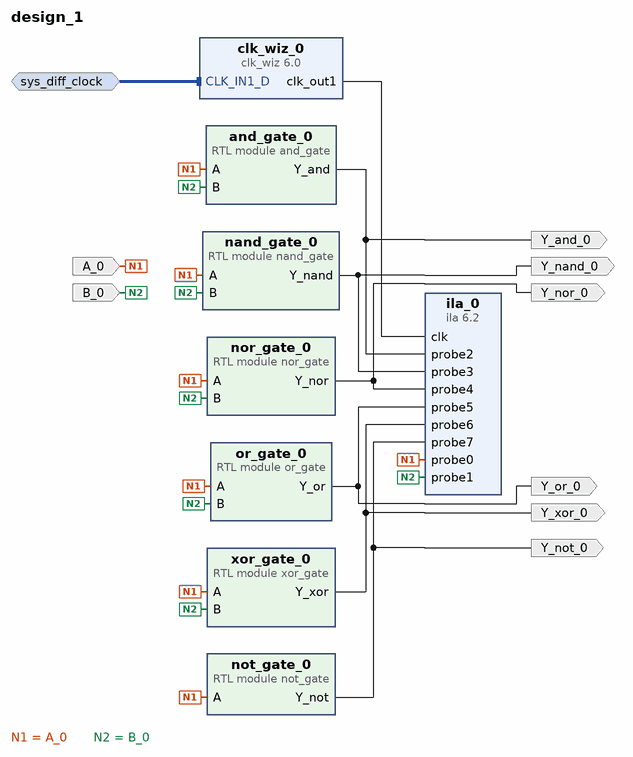
[diagram p0: block diagram of the top level]
# Vivado block design design_1, xc7z045ffg900-2, Vivado 2018.1
create_bd_design design_1

create_bd_intf_port -mode Slave -vlnv xilinx.com:interface:diff_clock_rtl:1.0 sys_diff_clock
set_property -dict {CONFIG.FREQ_HZ 200000000} [get_bd_intf_ports sys_diff_clock]
create_bd_port -dir I A_0
create_bd_port -dir I B_0
create_bd_port -dir O Y_and_0
create_bd_port -dir O Y_nand_0
create_bd_port -dir O Y_nor_0
create_bd_port -dir O Y_or_0
create_bd_port -dir O Y_xor_0
create_bd_port -dir O Y_not_0

create_bd_cell -type module -reference and_gate and_gate_0
create_bd_cell -type module -reference nand_gate nand_gate_0
create_bd_cell -type module -reference nor_gate nor_gate_0
create_bd_cell -type module -reference or_gate or_gate_0
create_bd_cell -type module -reference xor_gate xor_gate_0
create_bd_cell -type module -reference not_gate not_gate_0
create_bd_cell -type ip -vlnv xilinx.com:ip:ila:6.2 ila_0
set_property -dict [list \
  CONFIG.C_DATA_DEPTH 2048 \
  CONFIG.C_NUM_OF_PROBES 8 \
  CONFIG.C_ENABLE_ILA_AXI_MON false \
  CONFIG.C_MONITOR_TYPE Native \
] [get_bd_cells ila_0]
create_bd_cell -type ip -vlnv xilinx.com:ip:clk_wiz:6.0 clk_wiz_0
set_property -dict [list \
  CONFIG.CLKIN1_JITTER_PS 50.0 \
  CONFIG.PRIM_SOURCE Differential_clock_capable_pin \
  CONFIG.USE_LOCKED false \
  CONFIG.USE_RESET false \
  CONFIG.MMCM_DIVCLK_DIVIDE 1 \
  CONFIG.MMCM_CLKFBOUT_MULT_F 5.000 \
  CONFIG.MMCM_CLKIN1_PERIOD 5.000 \
  CONFIG.MMCM_CLKIN2_PERIOD 10.0 \
  CONFIG.USE_BOARD_FLOW true \
  CONFIG.CLK_IN1_BOARD_INTERFACE sys_diff_clock \
  CONFIG.CLKOUT1_JITTER 112.316 \
  CONFIG.CLKOUT1_PHASE_ERROR 89.971 \
] [get_bd_cells clk_wiz_0]

# ---- connections ----

connect_bd_intf_net [get_bd_intf_ports sys_diff_clock] [get_bd_intf_pins clk_wiz_0/CLK_IN1_D]
connect_bd_net -net A_0_1 [get_bd_ports A_0] \
  [get_bd_pins and_gate_0/A] [get_bd_pins nand_gate_0/A] [get_bd_pins nor_gate_0/A] [get_bd_pins or_gate_0/A] \
  [get_bd_pins xor_gate_0/A] [get_bd_pins not_gate_0/A] [get_bd_pins ila_0/probe0]
connect_bd_net -net B_0_1 [get_bd_ports B_0] \
  [get_bd_pins and_gate_0/B] [get_bd_pins nand_gate_0/B] [get_bd_pins nor_gate_0/B] [get_bd_pins or_gate_0/B] \
  [get_bd_pins xor_gate_0/B] [get_bd_pins ila_0/probe1]
connect_bd_net [get_bd_pins and_gate_0/Y_and] [get_bd_ports Y_and_0] [get_bd_pins ila_0/probe2]
connect_bd_net [get_bd_pins nand_gate_0/Y_nand] [get_bd_ports Y_nand_0] [get_bd_pins ila_0/probe3]
connect_bd_net [get_bd_pins nor_gate_0/Y_nor] [get_bd_ports Y_nor_0] [get_bd_pins ila_0/probe4]
connect_bd_net [get_bd_pins or_gate_0/Y_or] [get_bd_ports Y_or_0] [get_bd_pins ila_0/probe5]
connect_bd_net [get_bd_pins xor_gate_0/Y_xor] [get_bd_ports Y_xor_0] [get_bd_pins ila_0/probe6]
connect_bd_net [get_bd_pins not_gate_0/Y_not] [get_bd_ports Y_not_0] [get_bd_pins ila_0/probe7]
connect_bd_net [get_bd_pins clk_wiz_0/clk_out1] [get_bd_pins ila_0/clk]

validate_bd_design
save_bd_design
